# Altium schematic sheet SCNUC51V2.SchDoc
size A3
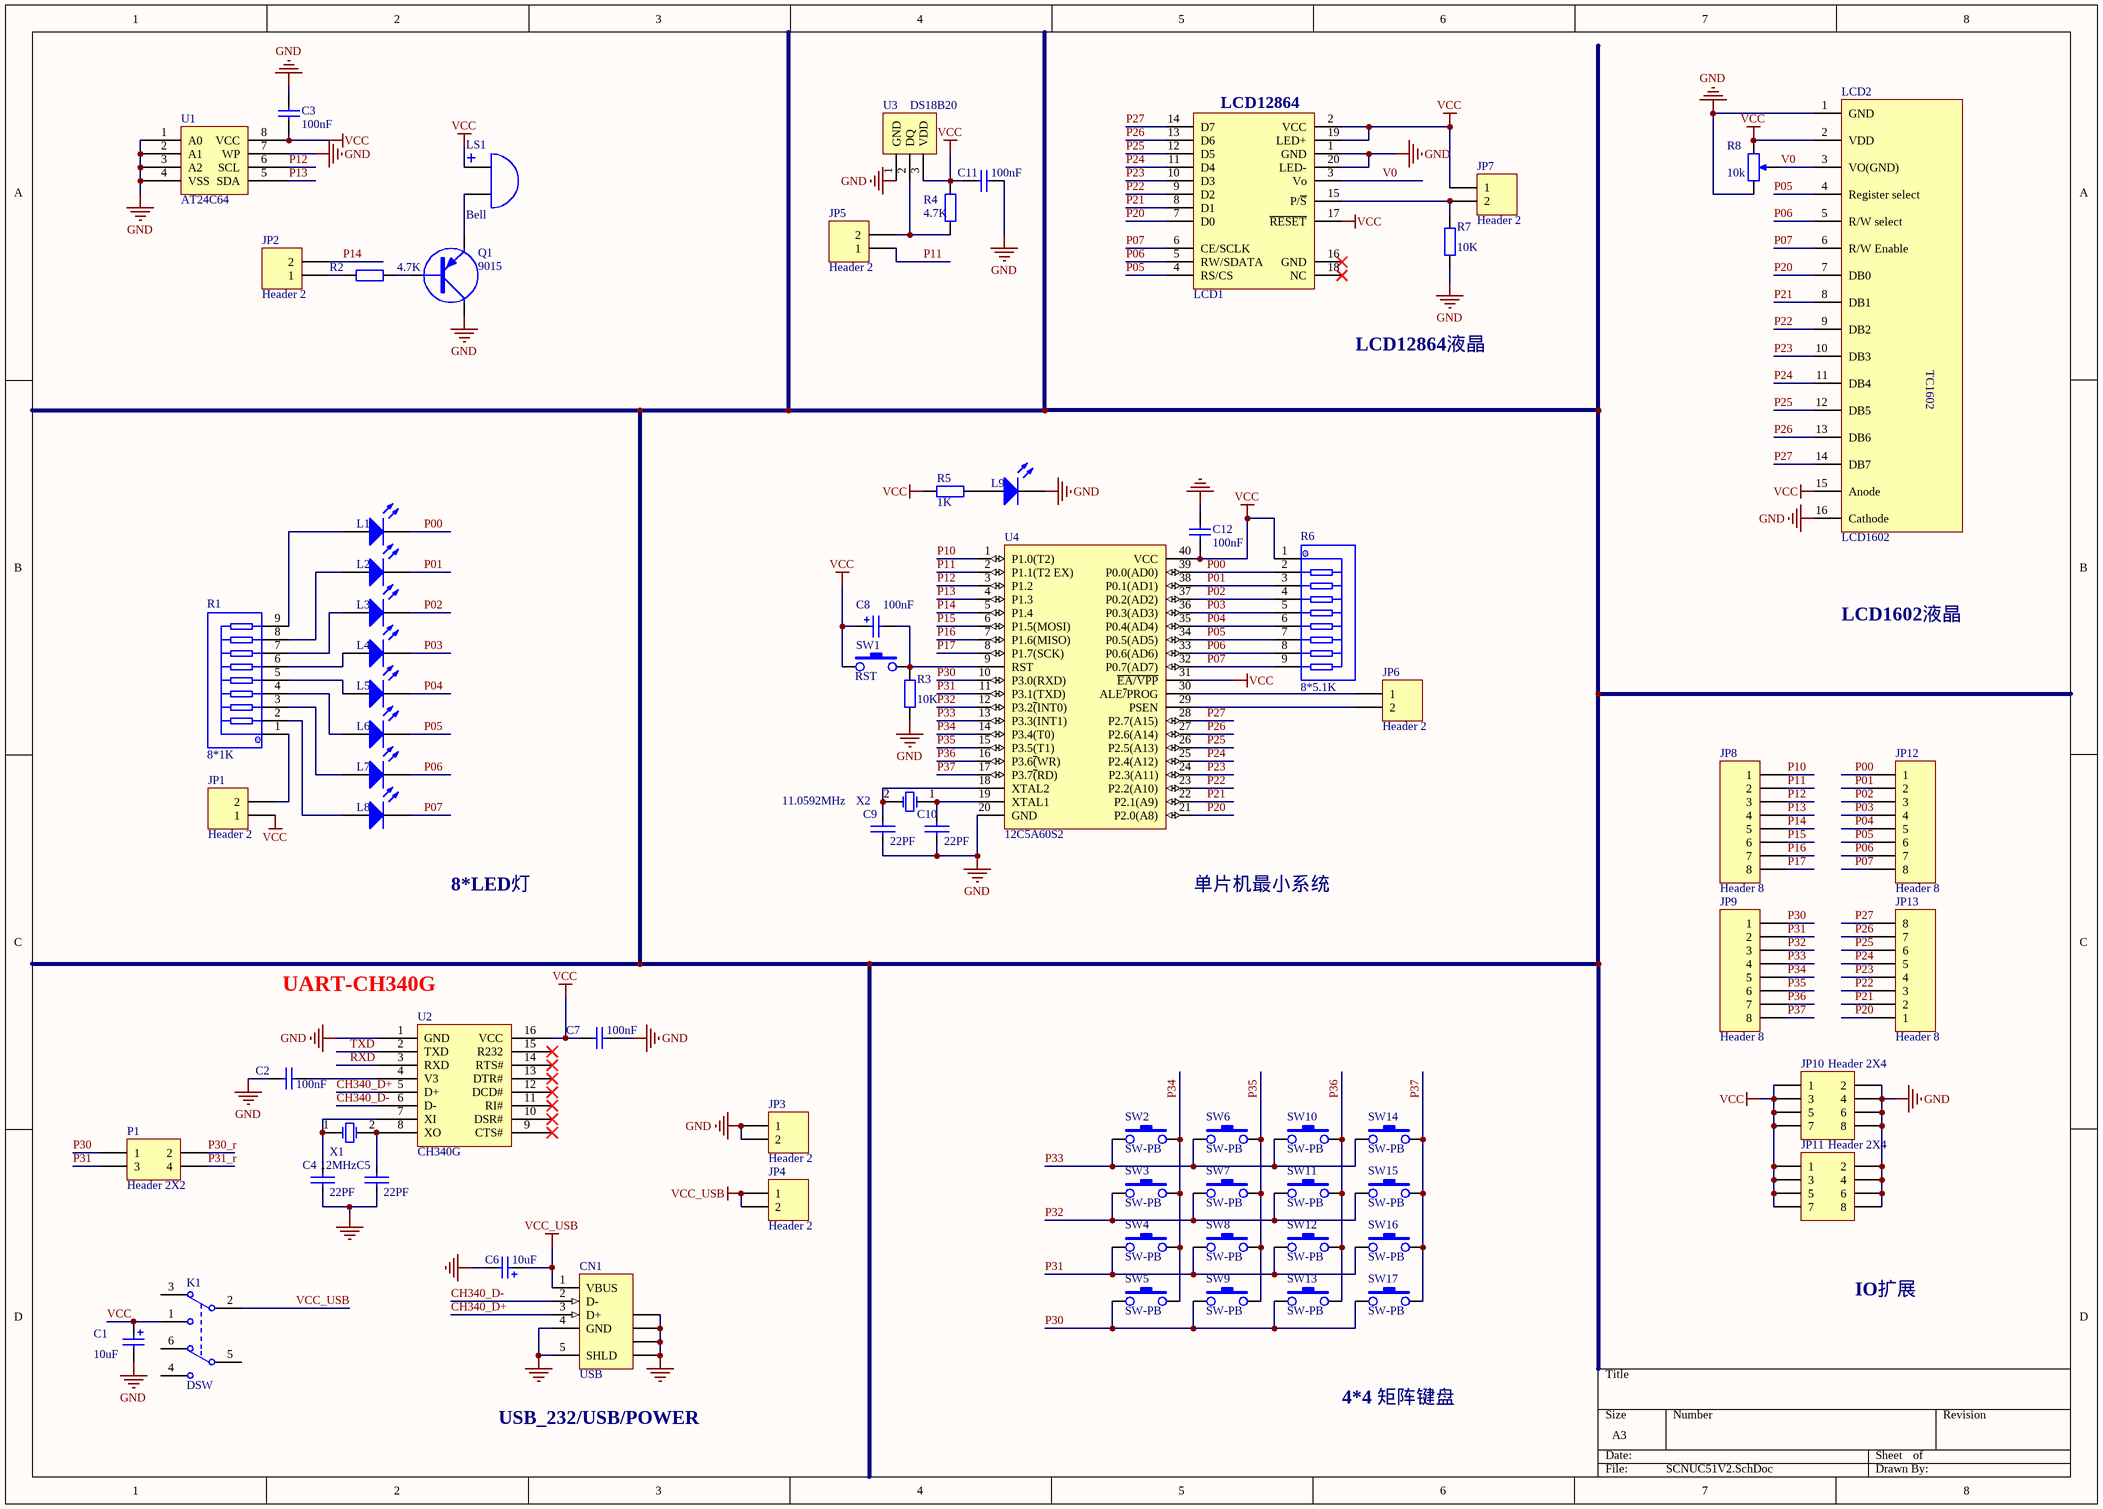
[diagram p0: SCNUC51V2.SchDoc]

## Parts
C1  value 10uF  [RB0.1-0.2]  (hidden comment: Cap)
C2  value 100nF  [C0805]  (hidden comment: Cap)
C3  value 100nF  [C0805]  (hidden comment: Cap)
C4  value 22PF  [C0805]  (hidden comment: CAP)
C5  value 22PF  [C0805]  (hidden comment: CAP)
C6  value 10uF  [RB0.1-0.2]  (hidden comment: Cap)
C7  value 100nF  [C0805]  (hidden comment: Cap)
C8  value 100nF  [C0805]  (hidden comment: CAP)
C9  value 22PF  [C0805]  (hidden comment: CAP)
C10  value 22PF  [C0805]  (hidden comment: CAP)
C11  value 100nF  [C0805]  (hidden comment: Cap)
C12  value 100nF  [C0805]  (hidden comment: Cap)
CN1  USB  [USB-mini]
JP1  Header 2  [HDR1X2]
JP2  Header 2  [HDR1X2]
JP3  Header 2  [HDR1X2]
JP4  Header 2  [HDR1X2]
JP5  Header 2  [HDR1X2]
JP6  Header 2  [HDR1X2]
JP7  Header 2  [HDR1X2]
JP8  Header 8  [HDR1X8]
JP9  Header 8  [HDR1X8]
JP10  Header 2X4  [HDR2-4]
JP11  Header 2X4  [HDR2-4]
JP12  Header 8  [HDR1X8]
JP13  Header 8  [HDR1X8]
K1  DSW  [DPDT-6]
L1  LED  [LED-3MM]  (value not drawn)
L2  LED  [LED-3MM]  (value not drawn)
L3  LED  [LED-3MM]  (value not drawn)
L4  LED  [LED-3MM]  (value not drawn)
L5  LED  [LED-3MM]  (value not drawn)
L6  LED  [LED-3MM]  (value not drawn)
L7  LED  [LED-3MM]  (value not drawn)
L8  LED  [LED-3MM]  (value not drawn)
L9  LED  [LED-3MM]  (value not drawn)
LCD1  LCD12864  [LCD12864F]  (value not drawn)
LCD2  LCD1602  [LCD1602]
LS1  Bell  [BELL0.3-0.46]
P1  Header 2X2  [HDR2X2]
Q1  9015  [TO-92]
R1  value 8*1K  [PIN-9]  (hidden comment: RES-8)
R2  value 4.7K  [R0805]  (hidden comment: Res)
R3  value 10K  [R0805]  (hidden comment: Res)
R4  value 4.7K  [R0805]  (hidden comment: Res)
R5  value 1K  [R0805]  (hidden comment: Res)
R6  value 8*5.1K  [PIN-9]  (hidden comment: RES-8)
R7  value 10K  [R0805]  (hidden comment: Res)
R8  value 10k  [VR-Z]  (hidden comment: RES-Pot2)
SW1  RST  [SW1]
SW2  SW-PB  [SW1]
SW3  SW-PB  [SW1]
SW4  SW-PB  [SW1]
SW5  SW-PB  [SW1]
SW6  SW-PB  [SW1]
SW7  SW-PB  [SW1]
SW8  SW-PB  [SW1]
SW9  SW-PB  [SW1]
SW10  SW-PB  [SW1]
SW11  SW-PB  [SW1]
SW12  SW-PB  [SW1]
SW13  SW-PB  [SW1]
SW14  SW-PB  [SW1]
SW15  SW-PB  [SW1]
SW16  SW-PB  [SW1]
SW17  SW-PB  [SW1]
U1  AT24C64  [DIP-8]
U2  CH340G  [SOP-127-16M]
U3  DS18B20  [BCY-3]
U4  12C5A60S2  [DIP-40]
X1  value 12MHz  [XTAL]  (hidden comment: XTAL)
X2  value 11.0592MHz  [XTAL]  (hidden comment: XTAL)

## Nets
GND: C1.2 C2.1 C3.2 C4.1 C5.1 C6.2 C7.2 C9.1 C10.1 C11.2 C12.2 CN1.4(GND) CN1.5(SHLD) CN1.6(SHLD) CN1.7(SHLD) CN1.8(SHLD) CN1.9(SHLD) JP3.1 JP3.2 JP10.2 JP10.4 JP10.6 JP10.8 JP11.2 JP11.4 JP11.6 JP11.8 L9.2(K) LCD1.1(GND) LCD1.20(LED-) LCD2.1(GND) LCD2.16(Cathode) Q1.3(C) R3.1 R7.1 R8.3(TOP) U1.1(A0) U1.2(A1) U1.3(A2) U1.4(VSS) U1.7(WP) U2.1(GND) U3.1(GND) U4.20(GND)
VCC: C1.1 C3.1 C7.1 C8.1 C11.1 C12.1 JP1.1 JP7.1 JP10.1 JP10.3 JP10.5 JP10.7 JP11.1 JP11.3 JP11.5 JP11.7 K1.1(NO1) LCD1.2(VCC) LCD1.17(~{RESET}) LCD1.19(LED+) LCD2.2(VDD) LCD2.15(Anode) LS1.1(A) R4.1 R5.1 R6.1 R8.1(BOT) SW1.1 U1.8(VCC) U2.16(VCC) U3.3(VDD) U4.31(~{EA/VPP}) U4.40(VCC)
VCC_USB: C6.1 CN1.1(VBUS) JP4.1 JP4.2 K1.2(COMMON1)
CH340_D+: CN1.3(D+) U2.5(D+)
CH340_D-: CN1.2(D-) U2.6(D-)
P00: JP12.1 L1.2(K) R6.2 U4.39(P0.0(AD0))
P01: JP12.2 L2.2(K) R6.3 U4.38(P0.1(AD1))
P02: JP12.3 L3.2(K) R6.4 U4.37(P0.2(AD2))
P03: JP12.4 L4.2(K) R6.5 U4.36(P0.3(AD3))
P04: JP12.5 L5.2(K) R6.6 U4.35(P0.4(AD4))
P05: JP12.6 L6.2(K) LCD1.4(RS/CS) LCD2.4(Register_select) R6.7 U4.34(P0.5(AD5))
P06: JP12.7 L7.2(K) LCD1.5(RW/SDATA) LCD2.5(R/W_select) R6.8 U4.33(P0.6(AD6))
P07: JP12.8 L8.2(K) LCD1.6(CE/SCLK) LCD2.6(R/W_Enable) R6.9 U4.32(P0.7(AD7))
P10: JP8.1 U4.1(P1.0(T2))
P11: JP5.1 JP8.2 U4.2(P1.1(T2_EX))
P12: JP8.3 U1.6(SCL) U4.3(P1.2)
P13: JP8.4 U1.5(SDA) U4.4(P1.3)
P14: JP2.2 JP8.5 U4.5(P1.4)
P15: JP8.6 U4.6(P1.5(MOSI))
P16: JP8.7 U4.7(P1.6(MISO))
P17: JP8.8 U4.8(P1.7(SCK))
P20: JP13.1 LCD1.7(D0) LCD2.7(DB0) U4.21(P2.0(A8))
P21: JP13.2 LCD1.8(D1) LCD2.8(DB1) U4.22(P2.1(A9))
P22: JP13.3 LCD1.9(D2) LCD2.9(DB2) U4.23(P2.2(A10))
P23: JP13.4 LCD1.10(D3) LCD2.10(DB3) U4.24(P2.3(A11))
P24: JP13.5 LCD1.11(D4) LCD2.11(DB4) U4.25(P2.4(A12))
P25: JP13.6 LCD1.12(D5) LCD2.12(DB5) U4.26(P2.5(A13))
P26: JP13.7 LCD1.13(D6) LCD2.13(DB6) U4.27(P2.6(A14))
P27: JP13.8 LCD1.14(D7) LCD2.14(DB7) U4.28(P2.7(A15))
P30: JP9.1 P1.1 SW5.1 SW9.1 SW13.1 SW17.1 U4.10(P3.0(RXD))
P30_r: P1.2
P31: JP9.2 P1.3 SW4.1 SW8.1 SW12.1 SW16.1 U4.11(P3.1(TXD))
P31_r: P1.4
P32: JP9.3 SW3.1 SW7.1 SW11.1 SW15.1 U4.12(P3.2~{(}INT0))
P33: JP9.4 SW2.1 SW6.1 SW10.1 SW14.1 U4.13(P3.3(INT1))
P34: JP9.5 SW2.2 SW3.2 SW4.2 SW5.2 U4.14(P3.4(T0))
P35: JP9.6 SW6.2 SW7.2 SW8.2 SW9.2 U4.15(P3.5(T1))
P36: JP9.7 SW10.2 SW11.2 SW12.2 SW13.2 U4.16(P3.6~{(}WR))
P37: JP9.8 SW14.2 SW15.2 SW16.2 SW17.2 U4.17(P3.7~{(}RD))
RXD: U2.3(RXD)
TXD: U2.2(TXD)
V0: LCD1.3(Vo) LCD2.3(VO(GND)) R8.2(TAP)
NetC2_2: C2.2 U2.4(V3)
NetC4_2: C4.2 U2.7(XI) X1.1(OSC1)
NetC5_2: C5.2 U2.8(XO) X1.2(OSC2)
NetC8_2: C8.2 R3.2 SW1.2 U4.9(RST)
NetC9_2: C9.2 U4.18(XTAL2) X2.2(OSC2)
NetC10_2: C10.2 U4.19(XTAL1) X2.1(OSC1)
NetJP1_2: JP1.2 R1.1
NetJP2_1: JP2.1 R2.1
NetJP5_2: JP5.2 R4.2 U3.2(DQ)
NetJP6_1: JP6.1 U4.30(ALE~{/}PROG)
NetJP6_2: JP6.2 U4.29(PSEN)
NetJP7_2: JP7.2 LCD1.15(P/~{S}) R7.2
NetL1_1: L1.1(A) R1.9
NetL2_1: L2.1(A) R1.8
NetL3_1: L3.1(A) R1.7
NetL4_1: L4.1(A) R1.6
NetL5_1: L5.1(A) R1.5
NetL6_1: L6.1(A) R1.4
NetL7_1: L7.1(A) R1.3
NetL8_1: L8.1(A) R1.2
NetL9_1: L9.1(A) R5.2
NetLS1_2: LS1.2(B) Q1.1(E)
NetQ1_2: Q1.2(B) R2.2

Not connected (* = marked no-connect by the designer): K1 3(NC1) 4(NO2) 5(COMMON2) 6(NC2); LCD1 16(GND)* 18(NC)*; U2 9(CTS#)* 10(DSR#)* 11(RI#)* 12(DCD#)* 13(DTR#)* 14(RTS#)* 15(R232)*

## Notes on the sheet
- LCD12864液晶
- LCD1602液晶
- 8*LED灯
- 单片机最小系统
- (near U2) UART-CH340G
- IO扩展
- (near CN1) USB_232/USB/POWER
- 4*4 矩阵键盘
- (in symbol LCD1602) TC1602

## Library data of the parts
C1 C6 C8 = Cap Pol1: Capacitor; Manufacturer: Generic Components; Class: Passive; Published: 08/06/2000; Publisher: Altium Hobart Technology Centre; SubClass: Capacitor
C2 C3 C7 C11 C12 = Cap: Capacitor
C4 C5 C9 C10 = CAP: Capacitor
CN1 = 440479-1: USB MINI; ContactMaterial: Phosphor Bronze; ContactPlating: Gold (30) over Nickel; PCB_Layout: Complies with manufacturer's recommendation.; DrillSize: Corresponds to nominal value.; PanelGround: Without; Published: 15-Jul-2004; DatasheetDocument: 28-Jan-2003; PackageDocument: 28-Jan-2003; PackageReference: 440479; Publisher: Altium Limited; HousingMaterial: Thermoplastic; ComponentLink1Description: Manufacturer Link; ComponentLink1URL: http://www.tycoelectronics.com/; ComponentLink2Description: Packaging Specification; ComponentLink2URL: http://ecommas.tycoelectronics.com/commerce/DocumentDelivery/DDEController?Action=showdoc&DocId=Customer+Drawing%7F440479%7FD%7Fpdf%7FEnglish%7FC_440479_D.pdf
JP1-JP7 = Header 2: Header, 2-Pin; Revision: 17-Jul-2002: Re-released for DXP Platform.; Publisher: Altium Limited
JP8 JP9 JP12 JP13 = Header 8: Header, 8-Pin; Revision: 17-Jul-2002: Re-released for DXP Platform.; Publisher: Altium Limited
JP10 JP11 = Header 2X4: Header, 4-Pin, Dual row; Manufacturer: Generic Components; Class: Connector
L1-L9 = LED-3MM
LCD2 = LCD1602: pin to pad: 1>9
LS1 = Bell: Electrical Bell; Manufacturer: Generic Components; Published: 1999
P1 = Header 2X2: Header, 2-Pin, Dual row; LatestRevisionDate: 17-Jul-2002; LatestRevisionNote: Re-released for DXP Platform.; Publisher: Altium Limited
Q1 = 9015: PNP
R1 R6 = RES-8: Resistor Array; Class: Passive; SubClass: Resistor
R2-R5 R7 = Res: Resistor; Manufacturer: Generic Components; Class: Passive; Published: 08/06/2000; Publisher: Altium Hobart Technology Centre; SubClass: Resistor
R8 = RES-Pot2: Potentiometer; Class: Passive; SubClass: Potentiometer
SW1 = SW-PB: Button
U2 = CH340G: USBtoUART
U3 = DS18B20: Programmable Resolution / 1-Wire Digital Thermometer
U4 = 89c51